# EAGLE design ohsnap_board_extraGND (EAGLE 9.4.2)
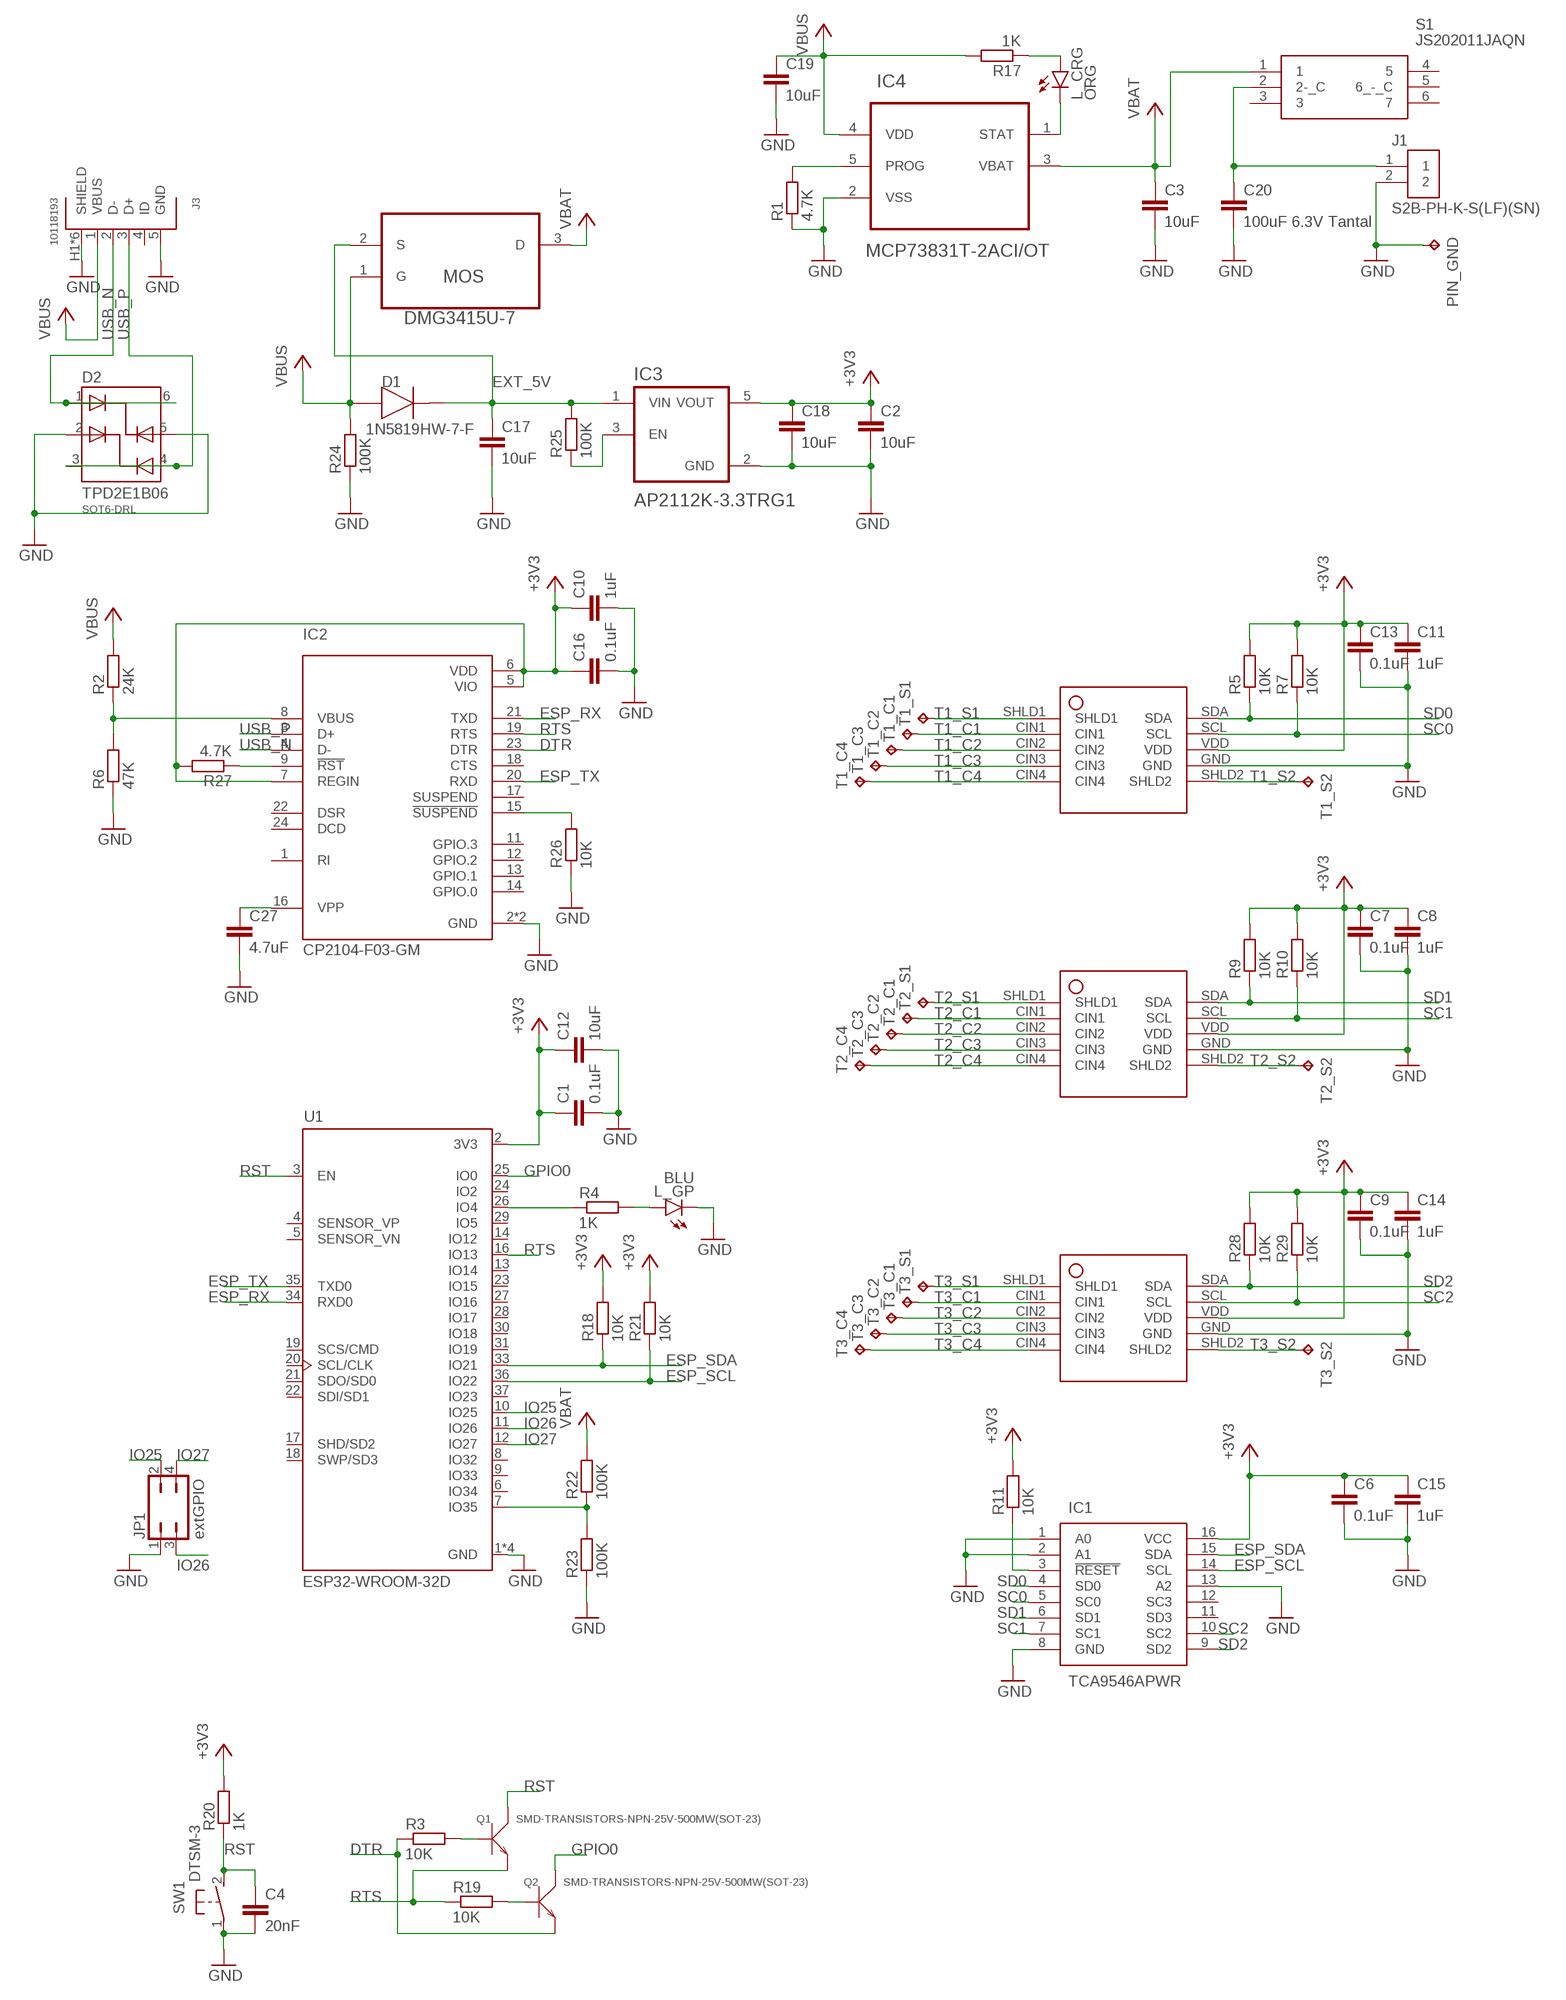
[diagram p0: schematic, sheet 1]

## Parts
C1  0.1uF  C-EUC0603  [C0603]
C2  10uF  C-EUC0805  [C0805]
C3  10uF  C-EUC0805  [C0805]
C4  20nF  C-EUC0603  [C0603]
C6  0.1uF  C-EUC0603  [C0603]
C7  0.1uF  C-EUC0603  [C0603]
C8  1uF  C-EUC0603  [C0603]
C9  0.1uF  C-EUC0603  [C0603]
C10  1uF  C-EUC0603  [C0603]
C11  1uF  C-EUC0603  [C0603]
C12  10uF  C-EUC0805  [C0805]
C13  0.1uF  C-EUC0603  [C0603]
C14  1uF  C-EUC0603  [C0603]
C15  1uF  C-EUC0603  [C0603]
C16  0.1uF  C-EUC0603  [C0603]
C17  10uF  C-EUC0805  [C0805]
C18  10uF  C-EUC0805  [C0805]
C19  10uF  C-EUC0805  [C0805]
C20  100uF 6.3V Tantal  C-EUC0805  [C0805]
C27  4.7uF  C-EUC0805  [C0805]
D1  1N5819HW-7-F  [SOD370155X135]
D2  TPD2E1B06  [SOT6-DRL]
IC1  TCA9546APWR  [SOP65P640X120-16N]
IC2  CP2104-F03-GM  [QFN50P400X400X80-25N]
IC3  AP2112K-3.3TRG1  [SOT95P285X140-5N]
IC4  MCP73831T-2ACI/OT  [SOT95P280X145-5N]
IC5  FDC1004_SOP10  [SOP50P490X109-10N]
IC6  FDC1004_SOP10  [SOP50P490X109-10N]
IC7  FDC1004_SOP10  [SOP50P490X109-10N]
J1  S2B-PH-K-S(LF)(SN)  [JST_S2B-PH-K-S(LF)(SN)]
J3  10118193  [10118193]
JP1  extGPIO  JP2Q  [JP2Q]
L_CRG  ORG  LEDSML0603  [SML0603]
L_GP  BLU  LEDSML0603  [SML0603]
MOS  DMG3415U-7  [SOT95P240X105-3N]
PIN_GND  TPB2,54  [B2,54]
Q1  SMD-TRANSISTORS-NPN-25V-500MW(SOT-23)  [SOT-23]
Q2  SMD-TRANSISTORS-NPN-25V-500MW(SOT-23)  [SOT-23]
R1  4.7K  R-EU_R0603  [R0603]
R2  24K  R-EU_R0603  [R0603]
R3  10K  R-EU_R0603  [R0603]
R4  1K  R-EU_R0603  [R0603]
R5  10K  R-EU_R0603  [R0603]
R6  47K  R-EU_R0603  [R0603]
R7  10K  R-EU_R0603  [R0603]
R9  10K  R-EU_R0603  [R0603]
R10  10K  R-EU_R0603  [R0603]
R11  10K  R-EU_R0603  [R0603]
R17  1K  R-EU_R0603  [R0603]
R18  10K  R-EU_R0603  [R0603]
R19  10K  R-EU_R0603  [R0603]
R20  1K  R-EU_R0603  [R0603]
R21  10K  R-EU_R0603  [R0603]
R22  100K  R-EU_R0603  [R0603]
R23  100K  R-EU_R0603  [R0603]
R24  100K  R-EU_R0603  [R0603]
R25  100K  R-EU_R0603  [R0603]
R26  10K  R-EU_R0603  [R0603]
R27  4.7K  R-EU_R0603  [R0603]
R28  10K  R-EU_R0603  [R0603]
R29  10K  R-EU_R0603  [R0603]
S1  JS202011JAQN  [JS202011JAQN]
SW1  DTSM-3  [DTSM-3]
T1_C1  TPB2,54  [B2,54]
T1_C2  TPB2,54  [B2,54]
T1_C3  TPB2,54  [B2,54]
T1_C4  TPB2,54  [B2,54]
T1_S1  T1_S1  TPB2,54  [B2,54]
T1_S2  T1_SHLD2  TPB2,54  [B2,54]
T2_C1  TPB2,54  [B2,54]
T2_C2  TPB2,54  [B2,54]
T2_C3  TPB2,54  [B2,54]
T2_C4  TPB2,54  [B2,54]
T2_S1  T2_SHLD1  TPB2,54  [B2,54]
T2_S2  T2_SHLD2  TPB2,54  [B2,54]
T3_C1  TPB2,54  [B2,54]
T3_C2  TPB2,54  [B2,54]
T3_C3  TPB2,54  [B2,54]
T3_C4  TPB2,54  [B2,54]
T3_S1  T3_SHLD1  TPB2,54  [B2,54]
T3_S2  T3_S2  TPB2,54  [B2,54]
U1  ESP32-WROOM-32D  [MODULE_ESP32-WROOM-32D]

## Nets
+3V3: C1.1 C2.1 C6.1 C7.1 C8.1 C9.1 C10.1 C11.1 C12.1 C13.1 C14.1 C15.1 C16.1 C18.1 IC1.16(VCC) IC2.5(VIO) IC2.6(VDD) IC2.7(REGIN) IC3.5(VOUT) IC5.VDD IC6.VDD IC7.VDD R5.2 R7.2 R9.2 R10.2 R11.2 R18.2 R20.2 R21.2 R27.2 R28.2 R29.2 U1.2(3V3)
DTR: IC2.23(DTR) Q2.2(E) R3.1
ESP_RX: IC2.21(TXD) U1.34(RXD0)
ESP_SCL: IC1.14(SCL) R21.1 U1.36(IO22)
ESP_SDA: IC1.15(SDA) R18.1 U1.33(IO21)
ESP_TX: IC2.20(RXD) U1.35(TXD0)
EXT_5V [pwr_supply]: C17.1 D1.1(C) IC3.1(VIN) MOS.2(S) R25.2
GND: C1.2 C2.2 C3.2 C4.2 C6.2 C7.2 C8.2 C9.2 C10.2 C11.2 C12.2 C13.2 C14.2 C15.2 C16.2 C17.2 C18.2 C19.2 C20.2 C27.2 D2.2(IOB1) D2.5(IOA2) IC1.1(A0) IC1.2(A1) IC1.8(GND) IC1.13(A2) IC2.2(GND) IC2.25(GND) IC3.2(GND) IC4.2(VSS) IC5.GND IC6.GND IC7.GND J1.2 J3.5(GND) J3.H1(SHIELD) J3.H2(SHIELD) J3.S1(SHIELD) J3.S2(SHIELD) J3.S3(SHIELD) J3.S4(SHIELD) JP1.1 L_GP.C PIN_GND.TP R1.1 R6.1 R23.1 R24.1 R26.1 SW1.1 U1.1(GND) U1.15(GND) U1.38(GND) U1.39(GND)
GPIO0: Q2.3(C) U1.25(IO0)
IO25: JP1.2 U1.10(IO25)
IO26: JP1.3 U1.11(IO26)
IO27: JP1.4 U1.12(IO27)
N$1: L_GP.A R4.2
N$2: R4.1 U1.26(IO4)
N$3: IC3.3(EN) R25.1
N$4: R22.1 R23.2 U1.7(IO35)
N$5: C20.1 J1.1 S1.2(2-_C)
N$6: IC2.15(!SUSPEND) R26.2
N$7: C27.1 IC2.16(VPP)
N$8: IC2.8(VBUS) R2.1 R6.2
N$9: IC2.9(!RST) R27.1
N$18: Q1.1(B) R3.2
N$19: Q2.1(B) R19.2
N$21: IC1.3(!RESET) R11.1
N$25: IC4.1(STAT) L_CRG.C
N$26: L_CRG.A R17.1
N$27: IC4.5(PROG) R1.2
RST: C4.1 Q1.3(C) R20.1 SW1.2 U1.3(EN)
RTS: IC2.19(RTS) Q1.2(E) R19.1 U1.16(IO13)
SC0: IC1.5(SC0) IC5.SCL R7.1
SC1: IC1.7(SC1) IC6.SCL R10.1
SC2: IC1.10(SC2) IC7.SCL R29.1
SD0: IC1.4(SD0) IC5.SDA R5.1
SD1: IC1.6(SD1) IC6.SDA R9.1
SD2: IC1.9(SD2) IC7.SDA R28.1
T1_C1: IC5.CIN1 T1_C1.TP
T1_C2: IC5.CIN2 T1_C2.TP
T1_C3: IC5.CIN3 T1_C3.TP
T1_C4: IC5.CIN4 T1_C4.TP
T1_S1: IC5.SHLD1 T1_S1.TP
T1_S2: IC5.SHLD2 T1_S2.TP
T2_C1: IC6.CIN1 T2_C1.TP
T2_C2: IC6.CIN2 T2_C2.TP
T2_C3: IC6.CIN3 T2_C3.TP
T2_C4: IC6.CIN4 T2_C4.TP
T2_S1: IC6.SHLD1 T2_S1.TP
T2_S2: IC6.SHLD2 T2_S2.TP
T3_C1: IC7.CIN1 T3_C1.TP
T3_C2: IC7.CIN2 T3_C2.TP
T3_C3: IC7.CIN3 T3_C3.TP
T3_C4: IC7.CIN4 T3_C4.TP
T3_S1: IC7.SHLD1 T3_S1.TP
T3_S2: IC7.SHLD2 T3_S2.TP
USB_N [diffpairs]: D2.1(IOA1) D2.6(NC) IC2.4(D-) J3.2(D-)
USB_P [diffpairs]: D2.3(NC) D2.4(IOB2) IC2.3(D+) J3.3(D+)
VBUS [pwr_supply]: C19.1 D1.2(A) IC4.4(VDD) J3.1(VBUS) MOS.1(G) R2.2 R17.2 R24.2
VCC: C3.1 IC4.3(VBAT) MOS.3(D) R22.2 S1.1 ; supply symbol labelled VBAT
Unconnected: IC1.11(SD3) IC1.12(SC3) IC2.1(RI) IC2.11(GPIO.3) IC2.12(GPIO.2) IC2.13(GPIO.1) IC2.14(GPIO.0) IC2.17(SUSPEND) IC2.18(CTS) IC2.22(DSR) IC2.24(DCD) J3.4(ID) S1.3 S1.4 S1.5(6_-_C) S1.6 U1.4(SENSOR_VP) U1.5(SENSOR_VN) U1.6(IO34) U1.8(IO32) U1.9(IO33) U1.13(IO14) U1.14(IO12) U1.17(SHD/SD2) U1.18(SWP/SD3) U1.19(SCS/CMD) U1.20(SCL/CLK) U1.21(SDO/SD0) U1.22(SDI/SD1) U1.23(IO15) U1.24(IO2) U1.27(IO16) U1.28(IO17) U1.29(IO5) U1.30(IO18) U1.31(IO19) U1.37(IO23)

## Library data of the parts
C1-C4 C6-C20 C27 = rcl:C-EU: CAPACITOR, European symbol; SPICEPREFIX: C
D1 = 1N5819HW-7-F:1N5819HW-7-F: 1N5819HW Series 40 V 1 A Surface Mount Schottky Barrier Rectifier - SOD-123; AVAILABILITY: Unavailable; DESCRIPTION: 1N5819HW Series 40 V 1 A Surface Mount Schottky Barrier Rectifier - SOD-123; MF: Diodes Inc.; MP: 1N5819HW-7-F; PACKAGE: SOD-123 Diodes Inc.; PRICE: None
D2 = borkedlabs-diodes:TPD2E1B06; MANU: TI; MPN: TPD2E1B06DRLR; PACKAGE: SOT6-DRL
IC1 = TCA9546APWR:TCA9546APWR: 1.65V to 5.5V 4-Channel I2C and SMBus Switch With Reset Function Source: Datasheet <http://www.ti.com/lit/gpn/tca9546a>; DESCRIPTION: 1.65V to 5.5V 4-Channel I2C and SMBus Switch With Reset Function; HEIGHT: 1.2mm; MANUFACTURER_NAME: Texas Instruments; MANUFACTURER_PART_NUMBER: TCA9546APWR; MOUSER_PART_NUMBER: 595-TCA9546APWR; MOUSER_PRICE-STOCK: https://www.mouser.com/Search/Refine.aspx?Keyword=595-TCA9546APWR
IC2 = CP2104-F03-GM:CP2104-F03-GM: USB-to-UART 1-CH 576byte FIFO 3.3V 24-Pin QFN EP T/R; DESCRIPTION: USB-to-UART 1-CH 576byte FIFO 3.3V 24-Pin QFN EP; DIGI-KEY_PART_NUMBER: 336-2008-5-ND; DIGI-KEY_PURCHASE_URL: https://www.digikey.de/product-detail/en/silicon-labs/CP2104-F03-GM/336-2008-5-ND/2486177?utm_source=snapeda&utm_medium=aggregator&utm_campaign=symbol; MF: Silicon Labs; MP: CP2104-F03-GM; PACKAGE: QFN-24 Silicon Labs
IC3 = AP2112K-3.3TRG1:AP2112K-3.3TRG1: AP2112 Series 0.6 A 3.3 V Fixed Output SMT LDO Linear Regulator - SOT23-5; AVAILABILITY: Unavailable; DESCRIPTION: AP2112 Series 0.6 A 3.3 V Fixed Output SMT LDO Linear Regulator - SOT23-5; MF: Diodes Inc.; MP: AP2112K-3.3TRG1; PACKAGE: SOT-753 Diodes Inc.; PRICE: None
IC4 = MCP73831T-2ACI_OT:MCP73831T-2ACI/OT: Charge Management Controller; AVAILABILITY: Unavailable; DESCRIPTION: MCP73831 Series Single-Cell Li-Ion/Li-Polymer Battery Charge Controller SOT-23-5; MF: Microchip; MP: MCP73831T-2ACI/OT; PACKAGE: SOT-23 Microchip; PRICE: None
IC5-IC7 = SOP50P490X109-10N:FDC1004_SOP10
J1 = jst_S2B-PH-K-S_LF__SN_:S2B-PH-K-S(LF)(SN): PH Series 2 Position 2.0 mm Through Hole Side Entry Shrouded Header; AVAILABILITY: Unavailable; DESCRIPTION: PH Series 2 Position 2.0 mm Through Hole Side Entry Shrouded Header; MF: JST Sales; MP: S2B-PH-K-S_LF__SN_; PACKAGE: None; PRICE: None
J3 = con-fci-fh:10118193: MICRO USB B Type Receptacle FCIconnect 10118193
JP1 = jumper_customized:JP2Q: JUMPER
L_CRG L_GP = led_customized:LED: LED OSRAM: - CHIPLED LG R971, LG N971, LY N971, LG Q971, LY Q971, LO R971, LY R971 LH N974, LH R974 LS Q976, LO Q976, LY Q976 LO Q996 - Hyper CHIPLED LW Q18S LB Q993, LB Q99A, LB R99A - SideLED LS A670, LO A670, LY A670, LG A670, LP A670 LB A673, LV A673, LT A673, LW A673 LH A674 LY A675 LS A676, LA A676, LO A676, LY A676, LW A676 LS A679, LY A679, LG A679 - Hyper Micro SIDELED® LS Y876, LA Y876, LO Y876, LY Y876 LT Y87S - SmartLED LW L88C, LW L88S LB L89C, LB L89S, LG L890 LS L89K, LO L89K, LY L89K LS L896, LA L896, LO L896, LY L896 - TOPLED LS T670, LO T670, LY T670, LG T670, LP T670 LSG T670, LSP T670, LSY T670, LOP T670, LYG T670 LG T671, LOG T671, LSG T671 LB T673, LV T673, LT T673, LW T673 LH T674 LS T676, LA T676, LO T676, LY T676, LB T676, LH T676, LSB T676, LW T676 LB T67C, LV T67C, LT T67C, LS T67K, LO T67K, LY T67K, LW E67C LS E67B, LA E67B, LO E67B, LY E67B, LB E67C, LV E67C, LT E67C LW T67C LS T679, LY T679, LG T679 LS T770, LO T770, LY T770, LG T770, LP T770 LB T773, LV T773, LT T773, LW T773 LH T774 LS E675, LA E675, LY E675, LS T675 LS T776, LA T776, LO T776, LY T776, LB T776 LHGB T686 LT T68C, LB T68C - Hyper Mini TOPLED® LB M676 - Mini TOPLED Santana® LG M470 LS M47K, LO M47K, LY M47K Source: http://www.osram.convergy.de LUXEON: - LUMILED® LXK2-PW12-R00, LXK2-PW12-S00, LXK2-PW14-U00, LXK2-PW14-V00 LXK2-PM12-R00, LXK2-PM12-S00, LXK2-PM14-U00 LXK2-PE12-Q00, LXK2-PE12-R00, LXK2-PE12-S00, LXK2-PE14-T00, LXK2-PE14-U00 LXK2-PB12-K00, LXK2-PB12-L00, LXK2-PB12-M00, LXK2-PB14-N00, LXK2-PB14-P00, LXK2-PB14-Q00 LXK2-PR12-L00, LXK2-PR12-M00, LXK2-PR14-Q00, LXK2-PR14-R00 LXK2-PD12-Q00, LXK2-PD12-R00, LXK2-PD12-S00 LXK2-PH12-R00, LXK2-PH12-S00 LXK2-PL12-P00, LXK2-PL12-Q00, LXK2-PL12-R00 Source: www.luxeon.com KINGBRIGHT: KA-3528ASYC Source: www.kingbright.com
MOS = DMG3415U-7:DMG3415U-7: P-CHANNEL ENHANCEMENT MODE MOSFET; AVAILABILITY: Unavailable; DESCRIPTION: DMG3415U Series 20 V 39 mOhm P-Channel Enhancement Mode Mosfet - SOT-23-3; MF: Diodes Inc.; MP: DMG3415U-7; PACKAGE: SOT-23-3 Diodes Inc.; PRICE: None
PIN_GND T1_C1-T1_C4 T1_S1 T1_S2 T2_C1-T2_C4 T2_S1 T2_S2 T3_C1-T3_C4 T3_S1 T3_S2 = testpad:TP: Test pad
Q1 Q2 = SMD-TRANSISTORS-NPN-25V-500MW_SOT-23_:SMD-TRANSISTORS-NPN-25V-500MW(SOT-23): 305010017; AVAILABILITY: Unavailable; DESCRIPTION: SMD Transistors NPN 25V-500mW;; MF: JCET; MP: S8050; PACKAGE: SOT-23-3 JCET; PRICE: None
R1-R7 R9-R11 R17-R29 = rcl:R-EU_: RESISTOR, European symbol; SPICEPREFIX: R
S1 = JS202011JAQN:JS202011JAQN: JS Series Sub-Miniature Slide Switch Source: Datasheet <https://www.ckswitches.com/media/1422/js.pdf>; AVAILABILITY: Unavailable; DESCRIPTION: Switch Slide Dpdt 300ma 6v; MF: C&K; MP: JS202011JAQN; PACKAGE: None; PRICE: None
SW1 = switch-tact:DTSM-3
U1 = ESP32-WROOM-32D:ESP32-WROOM-32D: IC: SoC; GPIO, I2C, I2S, IR, SD, SDIO, SPI, UART; 2.7÷3.6VDC; 20dBm; AVAILABILITY: Unavailable; DESCRIPTION: IC: SoC; GPIO, I2C, I2S, IR, SD, SDIO, SPI, UART; 2.7÷3.6VDC; 20dBm; MF: Espressif Systems; MP: ESP32-WROOM-32D; PACKAGE: Module Espressif Systems; PRICE: None

## Net classes
0 default: width 0.152 mm, drill 0.2 mm, clearance 0.152 mm
1 default_backup: width 0.25 mm, drill 0.3 mm, clearance 0.152 mm
2 smaller: width 0.076 mm
3 diffpairs: width 0.25 mm, drill 0.25 mm, clearance 0.25 mm to class 0, clearance 0.25 mm to class 1, clearance 0.006 mm to class 2, clearance 0.25 mm
4 pwr_supply: width 0.203 mm, drill 0.008 mm, clearance 0.152 mm to class 0, clearance 0.25 mm to class 3, clearance 0.152 mm

## Board
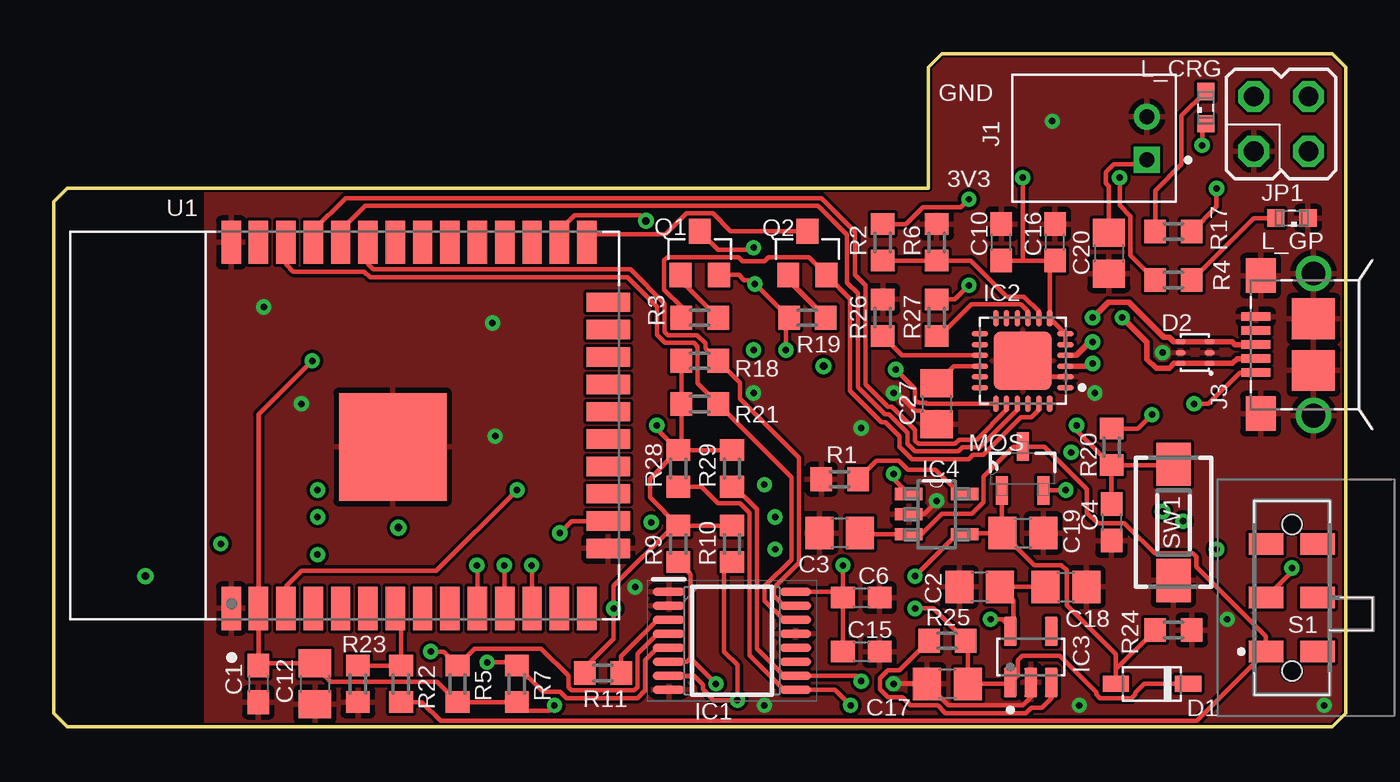
[diagram p1: board, top side]
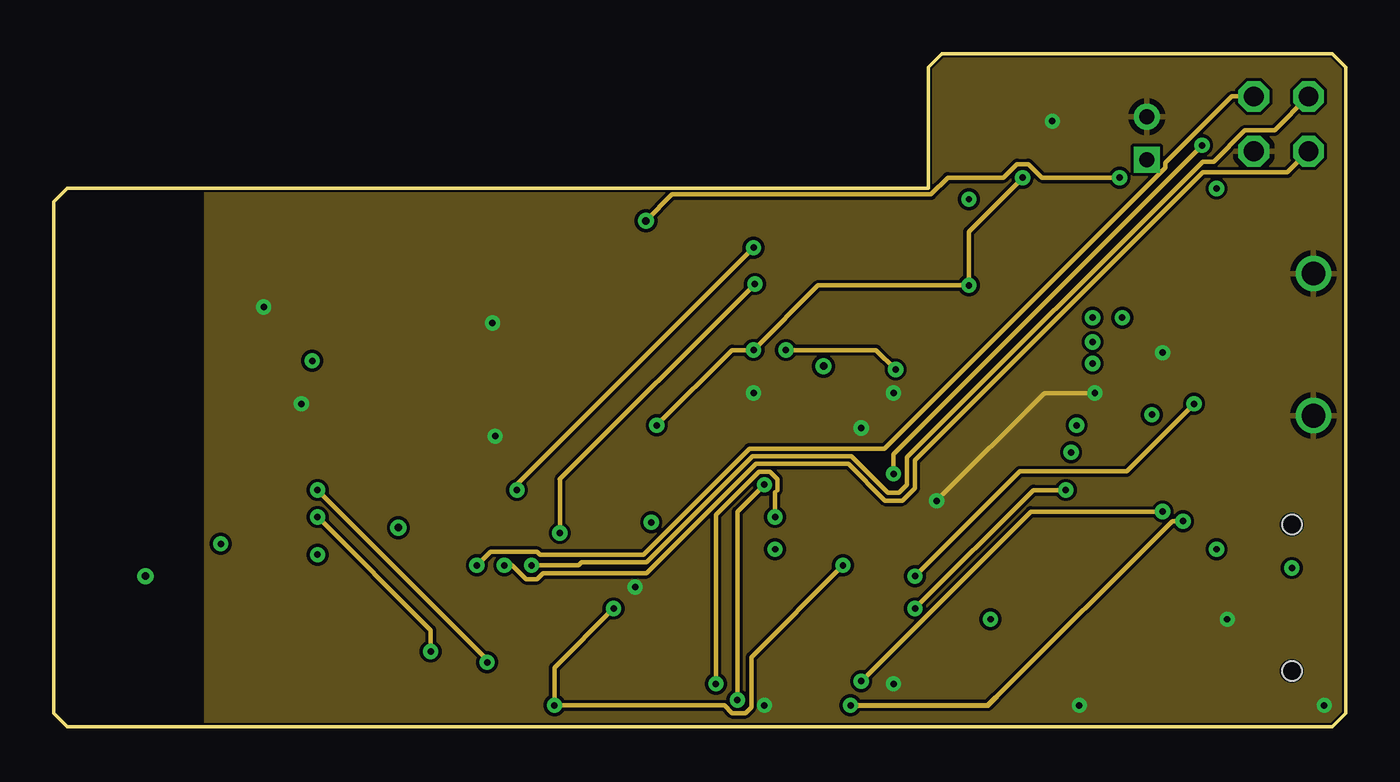
[diagram p2: board, inner layer Route2]
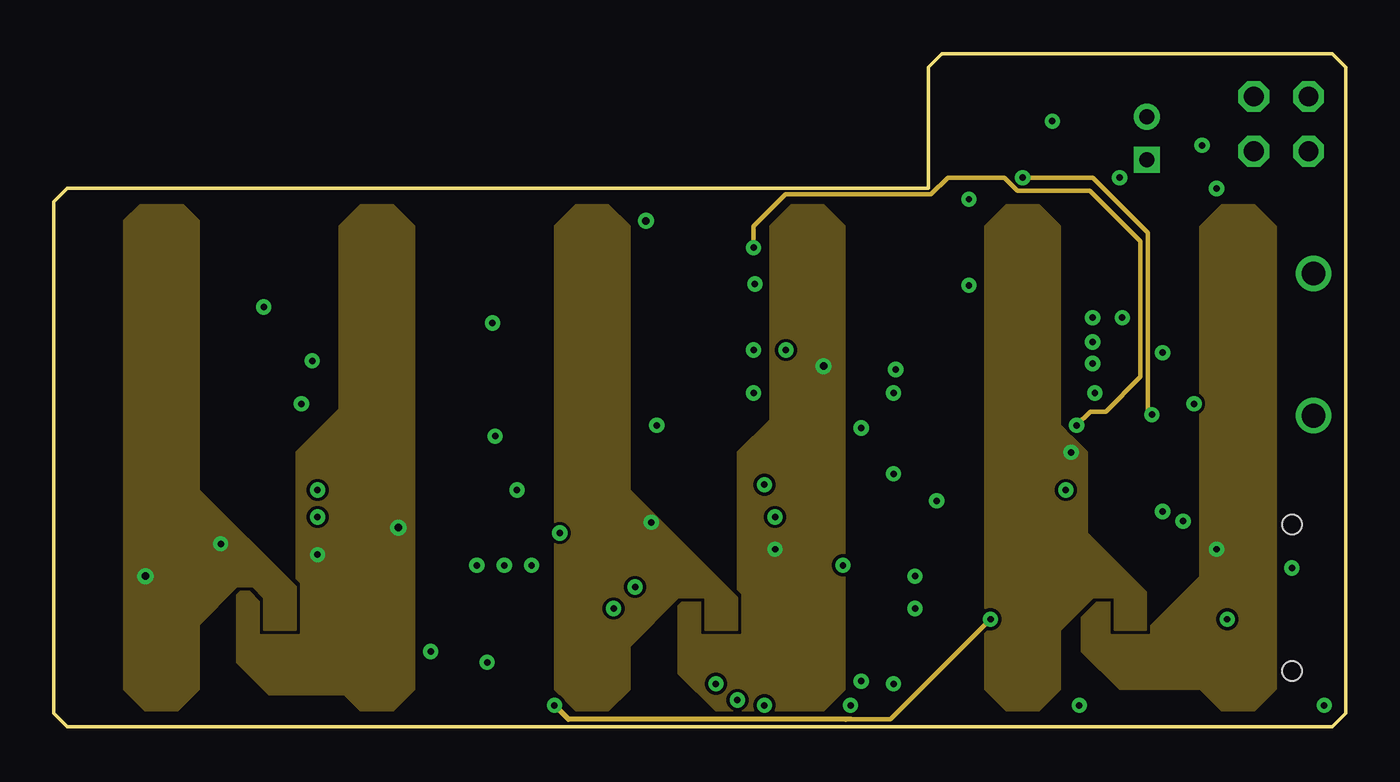
[diagram p3: board, inner layer Route15]
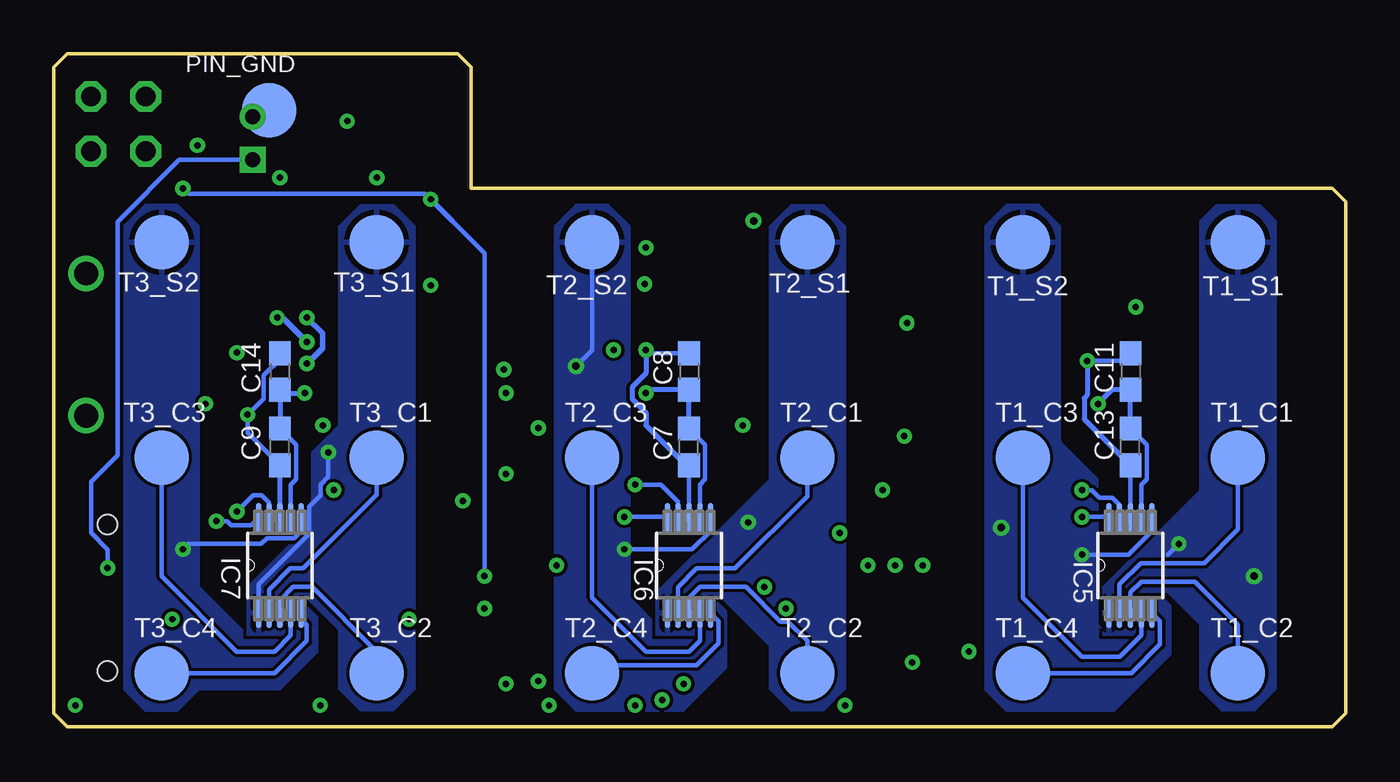
[diagram p4: board, bottom side, seen from below]

Size 60 x 31.25 mm. Coordinates in mm from the lower left corner, seen from the top.
Outline: 0,24.38 0,0.62 0.62,0 59.38,0 60,0.62 60,30.62 59.38,31.25 41.25,31.25 40.62,30.62 40.62,25 0.62,25 0,24.38
Copper layers (1+2*15+16): Top 0.035mm / dielectric 0.2mm / Route2 0.0175mm / dielectric 1.065mm / Route15 0.0175mm / dielectric 0.2mm / Bottom 0.035mm
Design rules "default *": minimum track width 8mil, minimum drill 0.2mm, track to track 6mil, track to pad 6mil, pad to pad 6mil, via to via 6mil, smd to smd 6mil, copper to edge 0.1mm, drill to drill 6mil, minimum pad ring 10mil, minimum via ring 8mil, stop-mask expansion 4mil, vias tented up to drill 0.4mm, thermal gap 10mil

### Footprints (pad centres in the part's own frame; a part is rotated, then mirrored left to right if it is on the bottom)
C0603 = smd 1.1 x 1: 1 -0.85,0; 2 0.85,0
C0805 = smd 1.3 x 1.5: 1 -0.95,0; 2 0.95,0
SOD370155X135 = smd 1.21 x 0.73: 1 -1.68,0; 2 1.68,0
SOT6-DRL = smd 0.25 x 0.45: 1 -0.5,-0.675; 2 0,-0.675; 3 0.5,-0.675; 4 0.5,0.675; 5 0,0.675; 6 -0.5,0.675
SOP65P640X120-16N = smd 1.475 x 0.4: 1 -2.938,2.275; 2 -2.938,1.625; 3 -2.938,0.975; 4 -2.938,0.325; 5 -2.938,-0.325; 6 -2.938,-0.975; 7 -2.938,-1.625; 8 -2.938,-2.275; 9 2.938,-2.275; 10 2.938,-1.625; 11 2.938,-0.975; 12 2.938,-0.325; 13 2.938,0.325; 14 2.938,0.975; 15 2.938,1.625; 16 2.938,2.275
QFN50P400X400X80-25N = smd 0.76 x 0.25: 1 -1.985,1.25; 2 -1.985,0.75; 3 -1.985,0.25; 4 -1.985,-0.25; 5 -1.985,-0.75; 6 -1.985,-1.25; 13 1.985,-1.25; 14 1.985,-0.75; 15 1.985,-0.25; 16 1.985,0.25; 17 1.985,0.75; 18 1.985,1.25 | smd 0.25 x 0.76: 7 -1.25,-1.985; 8 -0.75,-1.985; 9 -0.25,-1.985; 10 0.25,-1.985; 11 0.75,-1.985; 12 1.25,-1.985; 19 1.25,1.985; 20 0.75,1.985; 21 0.25,1.985; 22 -0.25,1.985; 23 -0.75,1.985; 24 -1.25,1.985 | smd 2.7 x 2.7: 25 0,0
SOT95P285X140-5N = smd 1.35 x 0.6: 1 -1.185,0.95; 2 -1.185,0; 3 -1.185,-0.95; 4 1.185,-0.95; 5 1.185,0.95
SOT95P280X145-5N = smd 1.27 x 0.559: 1 -1.295,0.94; 2 -1.295,0; 3 -1.295,-0.94; 4 1.295,-0.94; 5 1.295,0.94
SOP50P490X109-10N = smd 1.372 x 0.25: CIN1 -2.21,0.508; CIN2 -2.21,0; CIN3 -2.21,-0.508; CIN4 -2.21,-0.991; GND 2.21,-0.508; SCL 2.21,0.508; SDA 2.21,0.991; SHLD1 -2.21,0.991; SHLD2 2.21,-0.991; VDD 2.21,0
JST_S2B-PH-K-S(LF)(SN) = drill 0.7 square: 1 1,0 | drill 0.7: 2 -1,0
10118193 = smd 0.4 x 1.35: 1 -1.3,2.675; 2 -0.65,2.675; 3 0,2.675; 4 0.65,2.675; 5 1.3,2.675 | drill 1.1 pad 1.6: H1 -3.3,0; H2 3.3,0 | smd 1.6 x 1.4: S1 -3.2,2.45; S2 3.2,2.45 | smd 1.9 x 2: S3 -1.2,0; S4 1.2,0
JP2Q = drill 0.914 octagon: 1 -1.27,-1.27; 2 -1.27,1.27; 3 1.27,-1.27; 4 1.27,1.27
SML0603 = smd 0.8 x 0.8: A 0.75,0; C -0.75,0
SOT95P240X105-3N = smd 1.321 x 0.559: 1 -1.016,0.965; 2 -1.016,-0.965; 3 1.016,0
B2,54 = smd 2.54 x 2.54: TP 0,0
SOT-23 = smd 1.016 x 1.143: 1 -0.889,-1.016; 2 0.889,-1.016; 3 0,1.016
R0603 = smd 1 x 1.1: 1 -0.85,0; 2 0.85,0
JS202011JAQN = smd 1 x 1.6: 1 -2.5,1.2; 2 0,1.2; 3 2.5,1.2; 4 -2.5,-1.2; 5 0,-1.2; 6 2.5,-1.2 | hole 0.9: -3.4,0; 3.4,0
DTSM-3 = smd 2 x 1.6: 1 -2.7,0; 2 2.7,0
MODULE_ESP32-WROOM-32D = smd 2 x 0.9: 1 -8.5,5.26; 2 -8.5,3.99; 3 -8.5,2.72; 4 -8.5,1.45; 5 -8.5,0.18; 6 -8.5,-1.09; 7 -8.5,-2.36; 8 -8.5,-3.63; 9 -8.5,-4.9; 10 -8.5,-6.17; 11 -8.5,-7.44; 12 -8.5,-8.71; 13 -8.5,-9.98; 14 -8.5,-11.25; 25 8.5,-11.25; 26 8.5,-9.98; 27 8.5,-8.71; 28 8.5,-7.44; 29 8.5,-6.17; 30 8.5,-4.9; 31 8.5,-3.63; 32 8.5,-2.36; 33 8.5,-1.09; 34 8.5,0.18; 35 8.5,1.45; 36 8.5,2.72; 37 8.5,3.99; 38 8.5,5.26 | smd 0.9 x 2: 15 -5.715,-12.25; 16 -4.445,-12.25; 17 -3.175,-12.25; 18 -1.905,-12.25; 19 -0.635,-12.25; 20 0.635,-12.25; 21 1.905,-12.25; 22 3.175,-12.25; 23 4.445,-12.25; 24 5.715,-12.25 | smd 5 x 5: 39 -1,-2.24

### Placement (x,y rotation side)
C1  9.5,2 270 top
C2  43,6.5 180 top
C3  36.5,9 180 top
C4  49.12,9.5 270 top
C6  37.5,6 0 top
C7  30.5,13 90 bottom
C8  30.5,16.5 270 bottom
C9  49.5,13 90 bottom
C10  44,22.5 90 top
C11  10,16.5 270 bottom
C12  12.12,2 270 top
C13  10,13 90 bottom
C14  49.5,16.5 270 bottom
C15  37.5,3.5 0 top
C16  46.5,22.5 90 top
C17  41.5,2 180 top
C18  47,6.5 0 top
C19  45,9 0 top
C20  49,22 270 top
C27  41,15 270 top
D1  51,2 180 top
D2  53,17.38 90 top
IC1  31.5,4 0 top
IC2  45,17 180 top
IC3  45.38,3.25 90 top
IC4  41,9.88 0 top
IC5  10,7.5 90 bottom
IC6  30.5,7.5 90 bottom
IC7  49.5,7.5 90 bottom
J1  50.77,27.33 270 top
J3  58.5,17.75 90 top
JP1  57,28 0 top
L_CRG  53.5,28.75 90 top
L_GP  57.5,23.62 180 top
MOS  45,12 90 top
PIN_GND  50,28.62 0 bottom
Q1  30,22 0 top
Q2  35,22 0 top
R1  36.5,11.5 0 top
R2  38.5,22.5 90 top
R3  30,19 0 top
R4  52,20.75 0 top
R5  18.75,2 270 top
R6  41,22.5 270 top
R7  21.5,2 270 top
R9  29,8.5 90 top
R10  31.5,8.5 90 top
R11  25.5,2.5 180 top
R17  52,23 0 top
R18  30,17 180 top
R19  35,19 0 top
R20  49.12,13 90 top
R21  30,15 180 top
R22  16.12,2 270 top
R23  14.12,2 90 top
R24  52,4.5 180 top
R25  41.5,4 0 top
R26  38.5,19 270 top
R27  41,19 90 top
R28  29,12 90 top
R29  31.5,12 90 top
S1  57.5,6 90 top
SW1  52,9.5 90 top
T1_C1  5,12.5 0 bottom
T1_C2  5,2.5 0 bottom
T1_C3  15,12.5 0 bottom
T1_C4  15,2.5 0 bottom
T1_S1  5,22.5 0 bottom
T1_S2  15,22.5 0 bottom
T2_C1  25,12.5 0 bottom
T2_C2  25,2.5 0 bottom
T2_C3  35,12.5 0 bottom
T2_C4  35,2.5 0 bottom
T2_S1  25,22.5 0 bottom
T2_S2  35,22.5 0 bottom
T3_C1  45,12.5 0 bottom
T3_C2  45,2.5 0 bottom
T3_C3  55,12.5 0 bottom
T3_C4  55,2.5 0 bottom
T3_S1  45,22.5 270 bottom
T3_S2  55,22.5 0 bottom
U1  13.5,14 90 top

### Tracks (layer width: path | path; a pad name or v marks a point on that pad's centre or on a via)
+3V3  (via drill 0.3)
  Top 0.203: 45,21.65 C16.1 46.25,21.4 IC2.7 IC2.6 IC2.5 | C10.1 45,21.64 45,21.65 | IC1.16 36.38,6.28 C6.1 | 44.42,4.64 IC3.5 | C18.1 C2.1 44.56,5.89 44.56,4.5 44.42,4.64 | R29.2 R28.2 | R18.2 R21.2 29.15,13 R28.2 | R28.2 27.68,11.53 27.68,10.67 R9.2 | R9.2 R10.2 | v23.25,1 23,0.75 21.9,0.75 R7.2 R5.2 17.8,2.1 12.85,2.1 12.12,2.82 C12.1 9.6,2.95 C1.1 U1.2 9.51,14.51 v12,17 | R11.2 24.65,2.75 26,4.1 v26,5.5 26,6.55 28.8,9.35 R9.2 | R28.2 28,13.85 v28,14 | v42.5,20.5 41.85,19.85 R27.2 | v45,25.5 45,21.65 | v51,14.5 50.35,13.85 R20.2 | v43.5,5 44.06,5 44.42,4.64 | v36.65,7.5 C6.1 | v36.65,7.5 | C6.1 C15.1
  Route2 0.203: v26,5.5 23.25,2.75 v23.25,1 31.14,1 31.5,0.64 32.12,0.64 32.39,0.92 32.39,3.24 v36.65,7.5 | v28,14 31.5,17.5 v32.5,17.5 35.5,20.5 v42.5,20.5 42.5,23 v45,25.5
  Route15 0.203: v43.5,5 38.87,0.37 37,0.37 | v45,25.5 48.25,25.5 50.81,22.94 50.81,14.69 v51,14.5
  Route15 0.229: 37,0.37 36.78,0.37 36.77,0.36 23.89,0.36 v23.25,1
  Bottom 0.203: C7.1 30.5,12 | 30.5,12 IC6.VDD | C13.1 IC5.VDD | C14.1 49.5,17.07 50.26,16.32 50.26,15.25 v51,14.5 51,13.65 C9.1 | C8.1 32.35,17.35 v32.5,17.5 | v12,17 10.35,17 C11.1
  Bottom 0.229: v12,17 12,15.41 12.14,15.27 12.14,14.3 C13.1 | 30.5,12 32.5,14 32.5,14.59 33.15,15.23 33.15,15.77 32.5,16.41 v32.5,17.5 | IC7.VDD C9.1
DTR
  Top 0.203: R3.1 29.15,19.51 28.35,20.31 28.35,21.66 28.5,21.81 31.8,21.81 31.99,21.62 33.01,21.62 33.2,21.81 35.06,21.81 Q2.2 36.98,19.89 36.98,15.61 38.44,14.16 38.63,14.16 39.28,13.51 39.28,13 39.85,12.44 42.5,12.44 42.7,12.63 43.16,12.63 44.91,14.38 45.41,14.38 45.75,14.72 IC2.23
ESP_RX
  Top 0.203: U1.34 13.32,23.05 14.46,24.2 35.5,24.2 36.84,22.85 36.84,20.63 37.34,20.13 37.34,15.76 38.59,14.51 38.78,14.51 39.64,13.65 39.64,13.15 40,12.79 42,12.79 42.2,12.99 43.02,12.99 44.75,14.72 IC2.21
ESP_SCL
  Top 0.203: U1.36 10.78,21.48 11.11,21.14 14.42,21.14 14.68,20.88 26.64,20.88 28.01,19.51 28.01,18.2 28.38,17.83 29.73,17.83 29.9,17.66 29.9,15.95 R21.1 34.25,11.6 34.25,7.77 33.02,6.53 33.02,5.87 33.91,4.97 IC1.14
ESP_SDA
  Top 0.203: U1.33 14.59,21.48 14.83,21.24 26.79,21.24 28.37,19.66 28.37,18.35 28.53,18.19 29.88,18.19 30.26,17.81 30.26,17.59 R18.1 31.87,15.98 31.87,15.24 34.61,12.5 34.61,7.62 33.45,6.46 33.45,6.09 33.91,5.62 IC1.15
ESP_TX
  Top 0.203: U1.35 12.05,23.05 13.55,24.55 35.64,24.55 37.2,23 37.2,21 37.7,20.5 37.7,15.91 38.74,14.87 38.93,14.87 40,13.8 40,13.3 40.15,13.15 41.85,13.15 42.05,13.34 42.87,13.34 44.25,14.72 IC2.20
EXT_5V  (via drill 0.3)
  Top 0.203: D1.1 50.65,2 50.23,1.58 50.23,1.51 50.05,1.33 48.59,1.33 48.41,1.51 48.41,1.61 46.73,3.3 44.98,3.3 44.77,3.09 44.77,2.41 IC3.1 44.36,2 C17.1 42.45,3.9 R25.2 40.85,5.5 v40,5.5 | v47,11 46.98,10.98 MOS.2
  Route2 0.203: v40,5.5 45.5,11 v47,11
GND  (via drill 0.3)
  Top 0.203: IC2.25 45.75,16.25 IC2.2 | IC3.2 45.38,1.38 45,1 43.21,1 43.2,1 41.55,1 C17.2 | C27.2 40.36,14.69 40,14.69 39.19,15.5 v39,15.5 | IC4.2 39.74,9.91 40.45,9.91 41,10.46 v41,10.5
  Top 0.229: C17.2 v39,2
  Route2 0.203: v41,10.5 46,15.5 v48.35,15.5
  Bottom 0.203: IC6.GND 29.99,11.25 29.75,11.5 29.75,13.1 C7.2 | IC5.GND 9.49,11.25 9.25,11.5 9.25,13.1 C13.2 | IC7.GND 48.99,11.25 48.75,11.5 48.75,13.1 C9.2
  Bottom 0.229: C13.2 C11.2 10.85,15.65 v11.5,15 | C7.2 C8.2 32.35,15.65 v32.5,15.5 | C9.2 C14.2 49.35,15.5 v48.35,15.5
  other vias: 37.5,13.88 27,6.5 59,1 54.5,5 33,1 51.5,17.38 20.5,13.5 47.62,1 46.38,28.12 20.38,18.75 9.75,19.5
  pour Top: 41.25,31.25 59.38,31.25 60,30.62 60,0.62 59.38,0 7,0 7,25 40.62,25 40.62,30.62
  pour Route2: 41.25,31.25 59.38,31.25 60,30.62 60,0.62 59.38,0 7,0 7,25 40.62,25 40.62,30.62
GPIO0
  Top 0.203: Q2.3 31.44,23.02 30.61,23.84 29.39,23.84 28.41,22.87 25.12,22.87 U1.25
IO25  (via drill 0.3)
  Top 0.203: U1.10 19.67,7.48 v19.65,7.5
  Route2 0.203: v19.65,7.5 20.28,8.13 22.45,8.13 22.58,8 27.38,8 32.31,12.92 38.58,12.92 51.63,25.97 51.63,26.19 54.72,29.28 JP1.2
IO26  (via drill 0.3)
  Top 0.203: U1.11 20.94,7.48 v20.92,7.5
  Route2 0.203: v20.92,7.5 21.3,7.5 21.93,6.87 22.45,6.87 22.73,7.14 27.53,7.14 32.6,12.21 36.9,12.21 38.6,10.51 39.41,10.51 39.99,11.09 39.99,12.37 53.37,25.75 57.29,25.75 JP1.3
IO27  (via drill 0.3)
  Top 0.203: U1.12 22.21,7.48 v22.19,7.5
  Route2 0.203: v22.19,7.5 24.38,7.5 24.52,7.64 27.53,7.64 32.45,12.57 37.05,12.57 38.75,10.87 39.26,10.87 39.63,11.24 39.63,12.52 53.37,26.25 53.87,26.25 55.32,27.7 56.7,27.7 JP1.4
N$1
  Top 0.203: R4.2 55.73,23.62 L_GP.A
N$2  (via drill 0.3, 0.35)
  Top 0.203: R4.1 50,21.9 50,23.7 49.5,24.21 v49.5,25.5 | v27.5,23.5 27.25,23.75 24.2,23.75 23.48,23.04 U1.26
  Route2 0.203: v49.5,25.5 45.89,25.5 45.26,26.13 44.74,26.13 44.11,25.5 41.52,25.5 40.74,24.72 28.72,24.72 v27.5,23.5
N$3
  Top 0.203: IC3.3 46.33,1.33 45.89,0.9 45.4,0.9 45.15,0.64 44.15,0.64 44.14,0.64 41.41,0.64 41.05,1 39.8,1 39.42,1.37 38.74,1.37 38.37,1.74 38.37,2.26 38.74,2.63 39.28,2.63 R25.1
N$4
  Top 0.203: R23.2 R22.1 16.12,5.23 U1.7
N$5  (via drill 0.3)
  Top 0.203: S1.2 57.5,7.2 v57.5,7.38 | J1.1 50.58,26.13 49.24,26.13 48.87,25.76 48.87,25.24 49,25.11 C20.1
  Bottom 0.203: J1.1 54.17,26.33 57.04,23.46 57.04,12.61 58.27,11.38 58.27,9.01 57.5,8.23 v57.5,7.38
N$6
  Top 0.203: R26.2 39.4,17.25 IC2.15
N$7
  Top 0.203: C27.1 41.8,16.75 IC2.16
N$8
  Top 0.203: R2.1 R6.2 42.59,21.65 44.26,19.98 45.06,19.98 45.75,19.29 IC2.8
N$9
  Top 0.203: IC2.9 45.25,19.29 44.91,19.63 42.62,19.63 41.15,18.15 R27.1
N$18
  Top 0.203: Q1.1 29.11,20.74 R3.2
N$19
  Top 0.229: R19.2 34.11,20.74 Q2.1
N$21
  Top 0.203: R11.1 26.35,3.29 28.03,4.97 IC1.3
N$25  (via drill 0.3)
  Top 0.203: v39,11.75 39,11.52 IC4.1 | v53.33,27 53.33,27.83 L_CRG.C
  Route2 0.203: v39,11.75 39,12.67 v53.33,27
N$26
  Top 0.203: R17.1 51.15,24.9 52.38,26.12 52.38,28.38 L_CRG.A
N$27
  Top 0.203: IC4.5 42.08,10.81 40.95,11.95 39.66,11.95 39.25,12.36 38.21,12.36 R1.2
RST  (via drill 0.3)
  Top 0.203: SW1.2 51.95,12.15 R20.1 | R20.1 C4.1 | Q1.3 30.85,22.17 32.41,22.17 v32.5,22.25 | R20.1 47.5,13.78 v47.5,14 | U1.3 10.78,6.53 11.5,7.25 17.76,7.25 v21.51,11
  Route2 0.203: v21.51,11 21.51,11.26 v32.5,22.25
  Route15 0.203: v32.5,22.25 32.5,23.25 33.97,24.72 40.74,24.72 41.52,25.5 44.14,25.5 44.75,24.89 48.11,24.89 50.46,22.54 50.46,16.25 48.85,14.64 48.14,14.64 v47.5,14
RTS  (via drill 0.3)
  Top 0.203: U1.16 24.05,9.56 v23.5,9 | v34,17.5 34,18.85 R19.1 32.59,20.56 v32.56,20.56 32.38,20.75 32.06,20.75 31.82,20.98 Q1.2 | v39.09,16.59 40,15.69 40,15.19 40.15,15.05 40.51,15.05 40.54,15.02 IC2.19
  Route2 0.203: v23.5,9 23.5,11.48 23.49,11.49 v32.56,20.56 | v39.09,16.59 38.19,17.5 v34,17.5
SC0  (via drill 0.3)
  Top 0.203: v20.12,3 21.35,3 R7.1 22.72,1.63 23.51,1.63 23.8,1.34 27.1,1.34 27.46,1.7 27.46,3.1 27.96,3.6 28.49,3.6 IC1.5
  Route2 0.203: v12.25,11 20.12,3.12 v20.12,3
  Bottom 0.203: v12.25,11 11.8,11 11.45,10.65 10.83,10.65 10.51,10.32 IC5.SCL
SC1  (via drill 0.3)
  Top 0.203: R10.1 31.13,7.28 31.13,3.5 31.75,2.88 v31.75,1.25 30.64,1.25 30.14,1.75 30.14,1.96 29.73,2.38
  Top 0.229: IC1.7 29.73,2.38
  Route2 0.203: v33,11.25 31.75,10 v31.75,1.25
  Bottom 0.203: IC6.SCL 31.01,10.46 31.8,11.25 v33,11.25
SC2  (via drill 0.3)
  Top 0.203: v37.5,2.12 37.25,2.38 IC1.10 33.91,2.38 32.66,3.62 32.66,10.1 31.61,11.15 R29.1
  Route2 0.203: v37.5,2.12 45.38,10 v51.5,10
  Bottom 0.203: IC7.SCL 50,10.4 50.35,10.75 50.75,10.75 v51.5,10
SD0  (via drill 0.3)
  Top 0.203: v17.5,3.5 18.1,3.5 R5.1 19.53,3.63 22.63,3.63 23.9,2.37 23.9,1.84 24.05,1.7 26.95,1.7 27.1,1.84 27.1,3.4 28.03,4.33 IC1.4
  Route2 0.203: v12.25,9.75 17.5,4.5 v17.5,3.5
  Bottom 0.203: IC5.SDA 11.03,9.75 v12.25,9.75
SD1  (via drill 0.3)
  Top 0.203: R9.1 29.57,7.08 29.57,3.18 | 29.57,3.18 29.41,3.03 IC1.6 | v30.75,2 29.57,3.18
  Route2 0.203: v33.5,9.75 33.5,10.89 33.61,11 33.61,11.5 33.25,11.86 32.75,11.86 30.75,9.86 v30.75,2
  Bottom 0.203: IC6.SDA 31.53,9.75 v33.5,9.75
SD2  (via drill 0.3)
  Top 0.203: v37,1 36.27,1.72 IC1.9 33.91,1.72 32.3,3.33 32.3,9.95 31.86,10.4 30.84,10.4 30.09,11.15 R28.1
  Route2 0.203: v52.45,9.55 51.95,9.55 43.76,1.37
  Route2 0.229: 43.76,1.37 43.39,1 v37,1
  Bottom 0.203: v52.45,9.55 51.95,9.55 51.76,9.37 50.83,9.37 IC7.SDA
T1_C1
  Bottom 0.203: T1_C1.TP 5,9.17 6.56,7.61 9.52,7.61 10.51,6.62 IC5.CIN1
T1_C2
  Bottom 0.203: IC5.CIN2 10,6.25 9.5,6.75 7,6.75 5,4.75 T1_C2.TP
T1_C3
  Bottom 0.203: IC5.CIN3 9.49,4.25 10.49,3.25 12.25,3.25 15,6 T1_C3.TP
T1_C4
  Bottom 0.203: T1_C4.TP 9.96,2.5 8.62,3.83 8.62,4.91 IC5.CIN4
T1_S1  (via drill 0.3, 0.35)
  Bottom 0.203: v7.75,8.5 8.25,8
  other vias: 4.25,7
  pour Route15: 9.75,6 9.75,4.5 11.25,4.5 11.25,6.5 6.75,11 6.75,23.5 6,24.25 4,24.25 3.25,23.5 3.25,1.75 4.25,0.75 5.75,0.75 6.75,1.75 6.75,4.75 8.5,6.5 9.25,6.5
  pour Bottom: 9.75,4.25 11.25,4.25 11.25,6.5 6.75,11 6.75,23.5 6,24.25 4,24.25 3.25,23.5 3.25,1.75 4.25,0.75 5.75,0.75 6.75,1.75 6.75,4.75 8.25,6.25 9.75,6.25
T1_S2  (via drill 0.3, 0.35)
  Bottom 0.203: v12.25,8 10.11,8 9.01,9.1 IC5.SHLD2
  other vias: 16,9.25
  pour Route15 (rank 2): 9.75,6 9.75,4.5 11.25,4.5 11.25,8.75 11.25,12.75 13.25,14.75 13.25,23.25 14.25,24.25 15.75,24.25 16.75,23.25 16.75,1.75 15.75,0.75 14.25,0.75 13.5,1.5 10,1.5 8.5,3 8.5,6.5 9.25,6.5
  pour Bottom (rank 2): 9.75,6 9.75,4.5 11.25,4.5 11.5,4.75 11.5,11.5 13.25,13.25 13.25,23.25 14.25,24.25 15.75,24.25 16.75,23.25 16.75,1.75 15.75,0.75 10.75,0.75 8.12,3.38 8.12,5.62 8.75,6.25 9.5,6.25
T2_C1
  Bottom 0.203: T2_C1.TP 25,10.71 28.35,7.36 30.15,7.36 31.01,6.5 IC6.CIN1
T2_C2
  Bottom 0.203: T2_C2.TP 25,4 25.89,4.89 26.25,4.89 27.86,6.5 30,6.5 30.5,6 IC6.CIN2
T2_C3
  Bottom 0.203: IC6.CIN3 29.99,4 30.49,3.5 32.5,3.5 35,6 T2_C3.TP
T2_C4
  Bottom 0.203: T2_C4.TP 34.64,2.86 30.15,2.86 29.12,3.88 29.12,4.91 IC6.CIN4
T2_S1  (via drill 0.3)
  other vias: 27.75,9.5
  pour Route15: 30.25,6 30.25,4.5 31.75,4.5 31.75,6 26.75,11 26.75,23.25 25.75,24.25 24.25,24.25 23.25,23.25 23.25,1.75 24.25,0.75 25.75,0.75 26.75,1.75 26.75,3.75 29,6
  pour Bottom: 26.75,1.75 26.75,3.75 29,6 30.25,6 30.25,4.25 32,4.25 32,6.25 26.75,11.5 26.75,13.25 26.75,23.25 25.75,24.25 24.25,24.25 23.25,23.25 23.25,1.75 24.25,0.75 25.75,0.75
T2_S2  (via drill 0.3, 0.35)
  Bottom 0.203: T2_S2.TP 35,17.5 v35.75,16.75 | v33.5,8.25 30.36,8.25 29.51,9.1 IC6.SHLD2
  pour Route15 (rank 2): 30.25,6 30.25,4.5 31.75,4.5 31.75,12.75 33.25,14.25 33.25,23.25 34.25,24.25 35.75,24.25 36.75,23.25 36.75,1.75 35.75,0.75 30.75,0.75 29,2.5 29,6
  pour Bottom (rank 2): 30.25,6 30.25,4.5 31.75,4.5 33.25,6 33.25,23.25 34.25,24.25 35.75,24.25 36.75,23.25 36.75,1.75 35.75,0.75 30.75,0.75 28.75,2.75 28.75,6
T3_C1
  Bottom 0.203: IC7.CIN1 50.01,6.38 49.03,7.36 48.42,7.36 45,10.78 T3_C1.TP
T3_C2
  Bottom 0.203: T3_C2.TP 45,3.5 48,6.5 48.88,6.5 49.5,5.88 IC7.CIN2
T3_C3
  Bottom 0.203: IC7.CIN3 48.99,4.25 49.74,3.5 51.5,3.5 55,7 T3_C3.TP
T3_C4
  Bottom 0.203: IC7.CIN4 48.51,5 48.25,4.74 48.25,4 49.75,2.5 T3_C4.TP
T3_S1  (via drill 0.3)
  Bottom 0.203: v47.25,12.75 47.25,11.61 47.61,11.25 47.61,10.75 48.13,10.23 48.13,8.97 48.69,8.41 50.49,6.62 IC7.SHLD1
  pour Route15: 49.25,4.5 50.75,4.5 50.75,6.25 48,9 48,12.75 46.75,14 46.75,23.25 45.75,24.25 44.25,24.25 43.25,23.25 43.25,1.75 44.25,0.75 45.75,0.75 46.75,1.75 46.75,4.5 48.25,6 49.25,6
  pour Bottom: 49.25,4.25 51,4.25 51,6.5 48,9.5 48,12.75 46.75,14 46.75,23.25 45.75,24.25 44.25,24.25 43.25,23.25 43.25,1.75 44.25,0.75 45.75,0.75 46.75,1.75 46.75,4.5 48.25,6 49.25,6
T3_S2  (via drill 0.3)
  Bottom 0.203: v54,8.25 53.75,8.5 50.36,8.5 50.09,8.77 48.84,8.77 48.51,9.1 IC7.SHLD2
  pour Route15 (rank 2): 49.25,6 49.25,4.5 50.75,4.5 53.25,7 53.25,23.25 54.25,24.25 55.75,24.25 56.75,23.25 56.75,1.75 55.75,0.75 54.25,0.75 53.25,1.75 49.5,1.75 47.75,3.5 47.75,5.5 48.25,6
  pour Bottom (rank 2): 49.25,6 49.25,4.25 51,4.25 53.25,6.5 53.25,23.25 54.25,24.25 55.75,24.25 56.75,23.25 56.75,1.75 55.75,0.75 54.25,0.75 53.25,1.75 49.5,1.75 47.75,3.5 47.75,5.25 48.5,6
USB_N  (via drill 0.3)
  Top 0.25: IC2.4 47.49,17.25 48.12,17.88 v48.25,17.88 | J3.2 54.96,17.1 54.73,16.88 D2.1 D2.6 52.03,16.88 51.8,16.65 51.2,16.65 50.77,17.07 50.77,17.85 v49.62,19
  Bottom 0.25: v49.62,19 49.38,19 v48.25,17.88
USB_P  (via drill 0.3)
  Top 0.25: IC2.3 48.12,16.75 v48.25,16.88 | J3.3 54.86,17.75 54.73,17.88 D2.3 D2.4 52.03,17.88 51.8,18.1 51.55,18.1 49.93,19.73 48.98,19.73 v48.25,19
  Bottom 0.25: v48.25,19 47.52,18.27 47.52,17.57 48.22,16.88 v48.25,16.88
VBUS  (via drill 0.3)
  Top 0.203: MOS.1 44.03,9.03 44,9 42.36,9 IC4.4 41.94,8.94 v40,7 | v42.5,24.5 42.12,24.12 40.36,24.12 39.59,23.35 R2.2 | v54,25 54,24.15 R17.2 | R24.2 49.32,2.67 | 49.32,2.67 49.32,3.37 47.05,5.64 47.05,7.26 46.8,7.5 45.55,7.5 C19.1 | 49.32,2.67 D1.2 | D1.2 | J3.1 55.08,16.45 53.62,15 v52.96,15
  Top 0.229: C19.1 44,9
  Route2 0.203: v52.96,15 49.83,11.87 44.87,11.87 v40,7
  Bottom 0.203: 41.5,23.5 40,22 v40,7 | v42.5,24.5 42.75,24.75 53.75,24.75 v54,25
  Bottom 0.229: v42.5,24.5 41.5,23.5
VCC
  Top 0.203: C3.1 37.52,8.94 IC4.3 40.29,8.94 41.25,9.89 42.65,9.89 43.18,10.43 43.18,11.62 44.58,13.02 MOS.3 46,13.02 47.99,11.03 47.99,9.95 48.49,9.45 49,9.45 49.73,9.45 49.88,9.31 49.88,9.3 51.12,8.05 52.91,8.05 53.05,7.91 53.05,7.45 56.3,4.2 S1.1 53.09,0.28 17.96,0.28 17.09,1.15 R22.2

### Text on the board
tNames: GND | 3V3